# Altium schematic sheet ZHSD-BOOT-STORAGE.SchDoc
size A3; DocumentNumber: 9; SheetNumber: 9; SheetTotal: 17; Size: A3
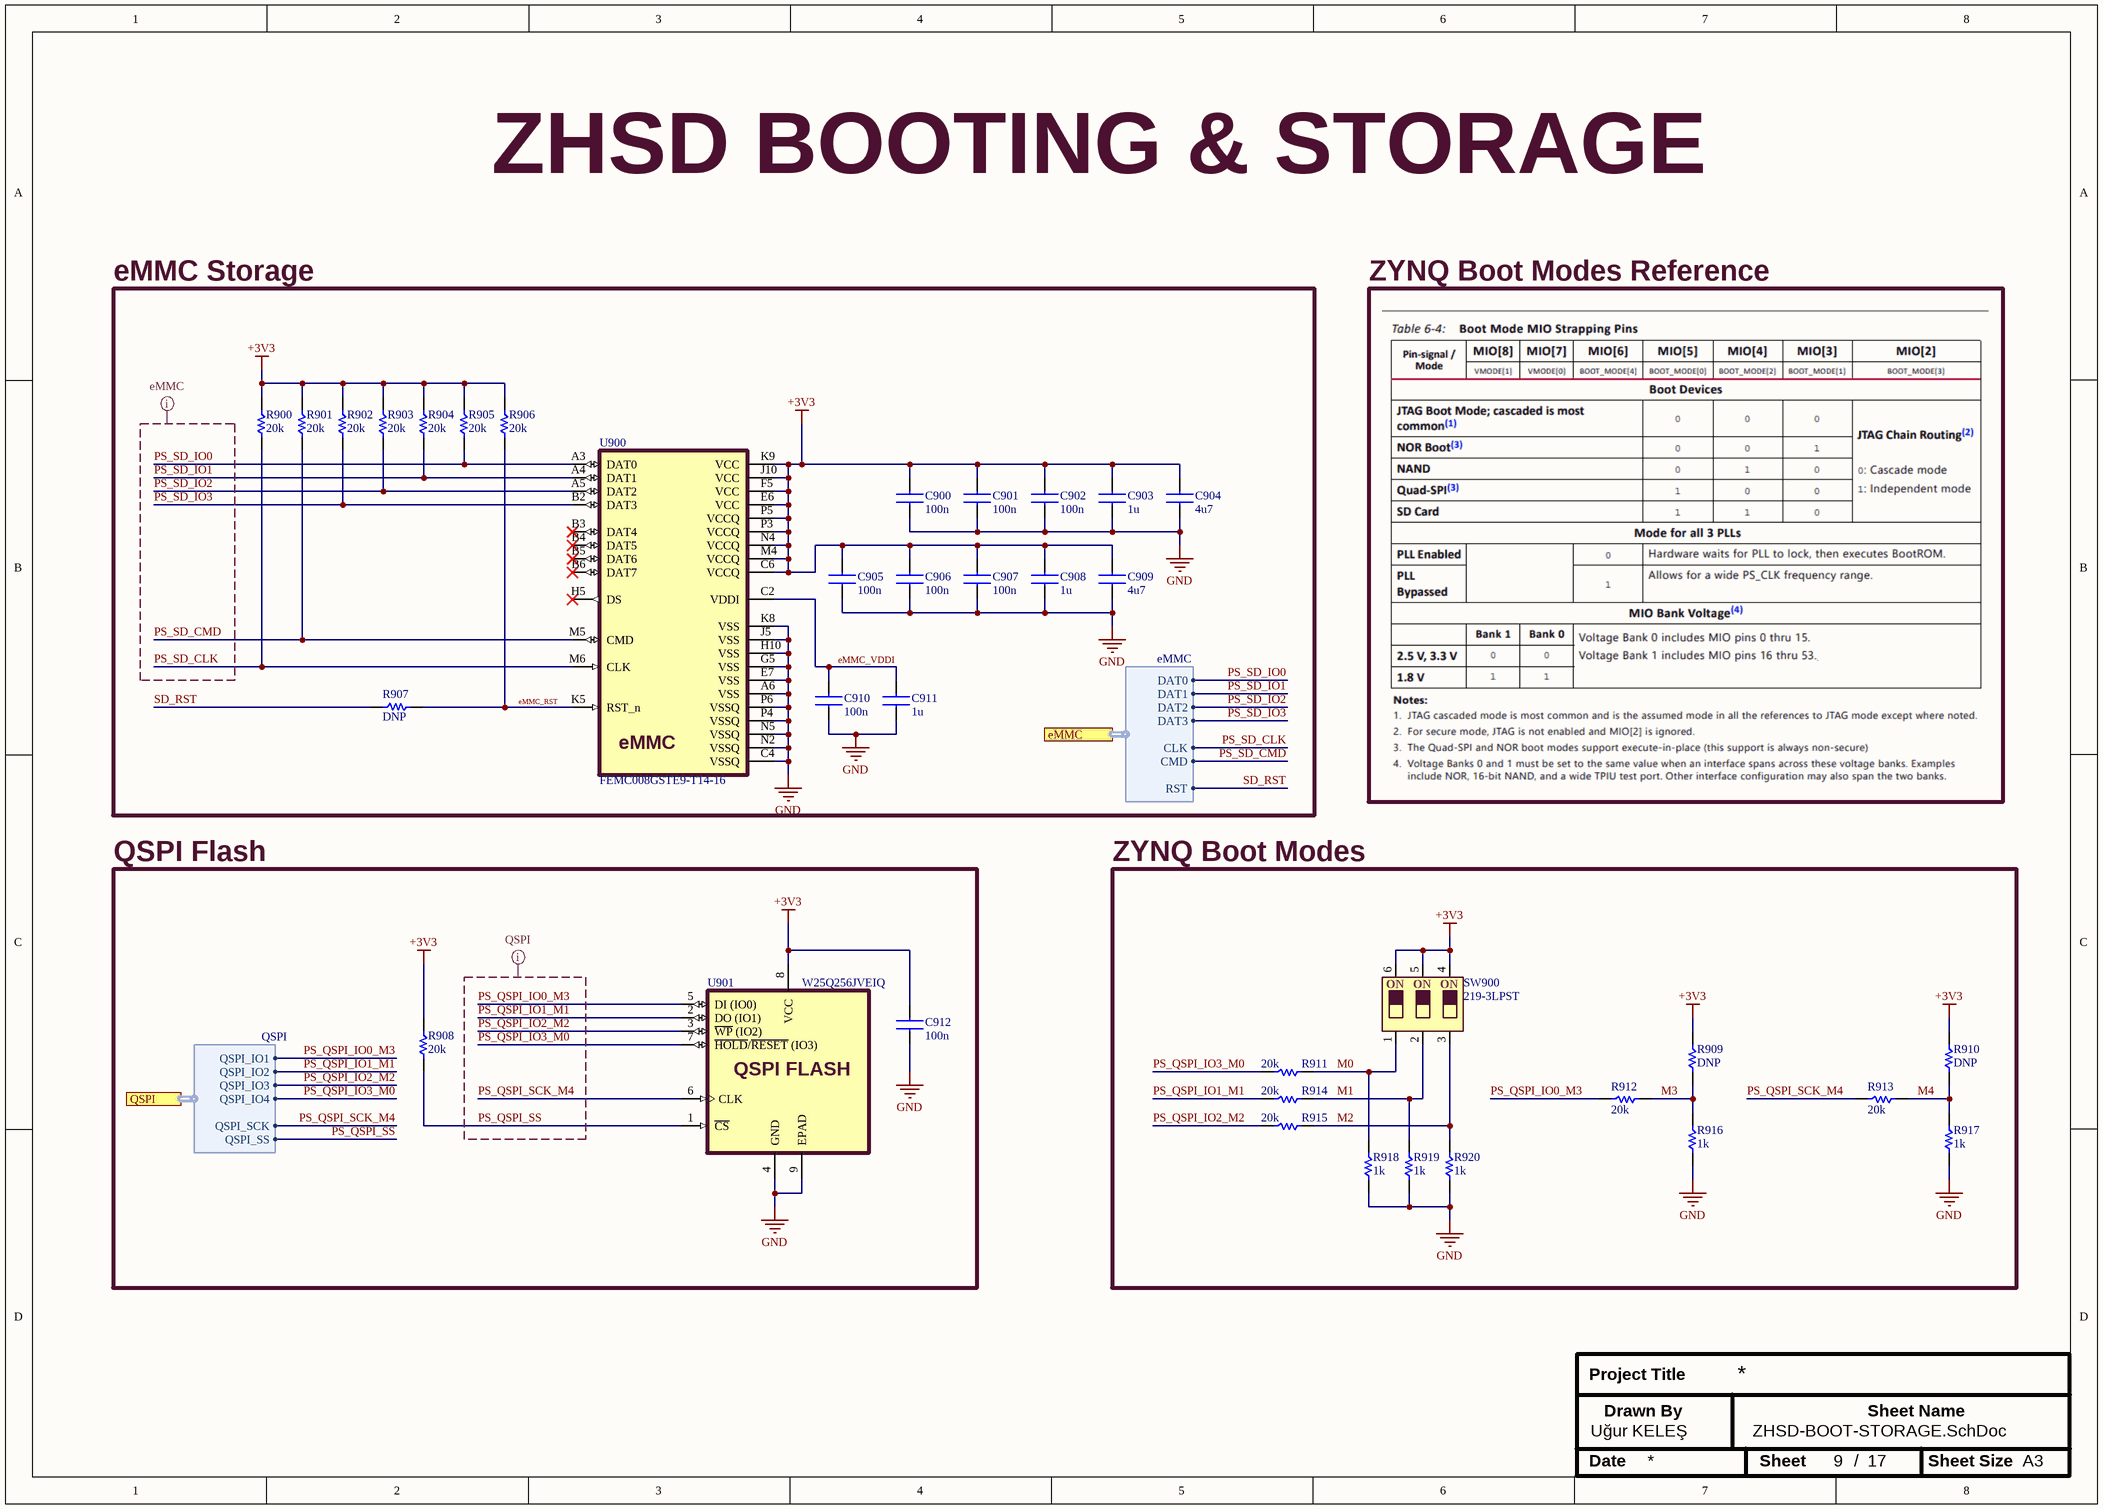
[diagram p0: ZHSD-BOOT-STORAGE.SchDoc]

## Parts
C900  100n  [0603CAPC1608X09N]
C901  100n  [0603CAPC1608X09N]
C902  100n  [0603CAPC1608X09N]
C903  1u  [0603CAPC1608X09N]
C904  4u7  [0603CAPC1608X09N]
C905  100n  [0603CAPC1608X09N]
C906  100n  [0603CAPC1608X09N]
C907  100n  [0603CAPC1608X09N]
C908  1u  [0603CAPC1608X09N]
C909  4u7  [0603CAPC1608X09N]
C910  100n  [0603CAPC1608X09N]
C911  1u  [0603CAPC1608X09N]
C912  100n  [0603CAPC1608X09N]
R900  20k  [0402RESC1005X04N]
R901  20k  [0402RESC1005X04N]
R902  20k  [0402RESC1005X04N]
R903  20k  [0402RESC1005X04N]
R904  20k  [0402RESC1005X04N]
R905  20k  [0402RESC1005X04N]
R906  20k  [0402RESC1005X04N]
R907  DNP  [0402RESC1005X04N]
R908  20k  [0402RESC1005X04N]
R909  DNP  [0402RESC1005X04N]
R910  DNP  [0402RESC1005X04N]
R911  20k  [0402RESC1005X04N]
R912  20k  [0402RESC1005X04N]
R913  20k  [0402RESC1005X04N]
R914  20k  [0402RESC1005X04N]
R915  20k  [0402RESC1005X04N]
R916  1k  [0402RESC1005X04N]
R917  1k  [0402RESC1005X04N]
R918  1k  [0402RESC1005X04N]
R919  1k  [0402RESC1005X04N]
R920  1k  [0402RESC1005X04N]
SW900  219-3LPST  [219-3LPST]
U900  FEMC008GSTE9-T14-16  [BGA153C50P14X14_1150X1300X100]
U901  W25Q256JVEIQ  [WSON8X6-SON127P800X80_HS-9N]

## Blocks framed on the sheet
eMMC Storage: C900-C911 R900-R907 U900
QSPI Flash: C912 R908 U901
ZYNQ Boot Modes: R909-R920 SW900

## Ports
eMMC (harness eMMC, see ZHSD-Block[8400,3700], ZHSD-ZYNQ-MIO[10600,2700]), QSPI (harness QSPI, see ZHSD-Block[8400,4400], ZHSD-ZYNQ-MIO[10200,8800])

## Harnesses
eMMC: DAT0, DAT1, DAT2, DAT3, CLK, CMD, RST
QSPI: QSPI_IO1, QSPI_IO2, QSPI_IO3, QSPI_IO4, QSPI_SCK, QSPI_SS

## Nets
+3V3: C900.2 C901.2 C902.2 C903.2 C904.2 C905.2 C906.2 C907.2 C908.2 C909.2 C912.2 R900.2 R901.2 R902.2 R903.2 R904.2 R905.2 R906.2 R908.2 R909.2 R910.2 SW900.4 SW900.5 SW900.6 U900.C6(VCCQ) U900.E6(VCC) U900.F5(VCC) U900.J10(VCC) U900.K9(VCC) U900.M4(VCCQ) U900.N4(VCCQ) U900.P3(VCCQ) U900.P5(VCCQ) U901.8(VCC)
GND: C900.1 C901.1 C902.1 C903.1 C904.1 C905.1 C906.1 C907.1 C908.1 C909.1 C910.1 C911.1 C912.1 R916.1 R917.1 R918.1 R919.1 R920.1 U900.A6(VSS) U900.C4(VSSQ) U900.E7(VSS) U900.G5(VSS) U900.H10(VSS) U900.J5(VSS) U900.K8(VSS) U900.N2(VSSQ) U900.N5(VSSQ) U900.P4(VSSQ) U900.P6(VSSQ) U901.4(GND) U901.9(EPAD)
eMMC_RST: R906.1 R907.2 U900.K5(RST_n)
eMMC_VDDI: C910.2 C911.2 U900.C2(VDDI)
M0: R911.1 R918.2 SW900.1
M1: R914.1 R919.2 SW900.2
M2: R915.1 R920.2 SW900.3
M3: R909.1 R912.1 R916.2
M4: R910.1 R913.1 R917.2
PS_QSPI_IO0_M3: R912.2 U901.5(DI_(IO0)) ; port QSPI.QSPI_IO1
PS_QSPI_IO1_M1: R914.2 U901.2(DO_(IO1)) ; port QSPI.QSPI_IO2
PS_QSPI_IO2_M2: R915.2 U901.3(~{WP}_(IO2)) ; port QSPI.QSPI_IO3
PS_QSPI_IO3_M0: R911.2 U901.7(~{HOLD}/~{RESET}_(IO3)) ; port QSPI.QSPI_IO4
PS_QSPI_SCK_M4: R913.2 U901.6(CLK) ; port QSPI.QSPI_SCK
PS_QSPI_SS: R908.1 U901.1(~{CS}) ; port QSPI.QSPI_SS
PS_SD_CLK: R900.1 U900.M6(CLK) ; port eMMC.CLK
PS_SD_CMD: R901.1 U900.M5(CMD) ; port eMMC.CMD
PS_SD_IO0: R905.1 U900.A3(DAT0) ; port eMMC.DAT0
PS_SD_IO1: R904.1 U900.A4(DAT1) ; port eMMC.DAT1
PS_SD_IO2: R903.1 U900.A5(DAT2) ; port eMMC.DAT2
PS_SD_IO3: R902.1 U900.B2(DAT3) ; port eMMC.DAT3
SD_RST: R907.1 ; port eMMC.RST

Not connected (* = marked no-connect by the designer): U900 B3(DAT4)* B4(DAT5)* B5(DAT6)* B6(DAT7)* H5(DS)*

## Layout directives
net class eMMC; rule Matched Net Lengths [Delay Tolerance = 50ps]: PS_SD_CLK, PS_SD_CMD, PS_SD_IO0, PS_SD_IO1, PS_SD_IO2, PS_SD_IO3
rule Matched Net Lengths [Delay Tolerance = 50ps]; net class QSPI: PS_QSPI_IO0_M3, PS_QSPI_IO1_M1, PS_QSPI_IO2_M2, PS_QSPI_IO3_M0, PS_QSPI_SCK_M4, PS_QSPI_SS

## Notes on the sheet
- ZHSD BOOTING & STORAGE
- ZYNQ Boot Modes Reference
- Project Title
- Uğur KELEŞ
- Drawn By
- Sheet Name
- Date
- Sheet
- /
- Sheet Size
- A3
- (in symbol 219-3LPST) ON
- (in symbol FEMC008GSTE9-T14-16) eMMC
- (in symbol W25Q256JVEIQ) QSPI FLASH

## Library data of the parts
C900-C902 C905-C907 C910 C912 = GRM155R71C104KA88J: CAP CER 0.1UF 16V X7R 0402 (1005) ±10%; Manufacturer: Murata Electronics; Value: 0.1 µF; ComponentLink1Description: Datasheet; ComponentLink1URL: https://search.murata.co.jp/Ceramy/image/img/A01X/G101/ENG/GRM155R71C104KA88-01.pdf; MPN: GRM155R71C104KA88J; Package: 0402; Tolerance: ±10%; Voltage: 16V
C903 C908 C911 = GRM188R61E105KA12D: CAP CER 1UF 25V X5R 0603 (1608) ±10%; Manufacturer: Murata Power Solutions Inc.; Value: 1 µF; ComponentLink1Description: Datasheet; ComponentLink1URL: https://search.murata.co.jp/Ceramy/image/img/A01X/G101/ENG/GRM188R61E105KA12-01.pdf; MPN: GRM188R61E105KA12D; Package: 0603; Tolerance: ±10%; Voltage: 25V
C904 C909 = CL10A475KP8NNNC: CAP CER 4.7UF 10V X5R 0603 (1608) ±10%; Manufacturer: Samsung Electro-Mechanics; Value: 4.7 µF; ComponentLink1Description: Datasheet; ComponentLink1URL: https://mm.digikey.com/Volume0/opasdata/d220001/medias/docus/609/CL10A475KP8NNNC_Spec.pdf; MPN: CL10A475KP8NNNC; Package: 0603; Tolerance: ±10%; Voltage: 10V
R900-R906 R908 R911-R915 = RC0402FR-0720KL: RES 20K OHM 1% 1/16W 0402 (1005); Manufacturer: YAGEO; Value: 20 kOhms; Voltage: 50V; ComponentLink1Description: Datasheet; ComponentLink1URL: https://yageogroup.com/content/datasheet/asset/file/PYU-RT_1-TO-0-01_ROHS_L; MPN: RC0402FR-0720KL; Tolerance: ±1%; Package: 0402
R907 R909 R910 = DNP_RES: DO NOT POPULATE RESISTOR; Manufacturer: ***; Value: ***; ComponentLink1Description: Datasheet; ComponentLink1URL: https://yageogroup.com/content/datasheet/asset/file/PYU-RT_1-TO-0-01_ROHS_L; MPN: ***; Voltage: ***; Tolerance: ***; Package: 0402
R916-R920 = RC0402JR-071KL: RES 1K OHM 5% 1/16W 0402 (1005); Manufacturer: YAGEO; Value: 1 kOhms; Voltage: 50V; ComponentLink1Description: Datasheet; ComponentLink1URL: https://yageogroup.com/content/datasheet/asset/file/PYU-RT_1-TO-0-01_ROHS_L; MPN: RC0402JR-071KL; Tolerance: ±5%; Package: 0402
SW900 = 219-3LPST: Dip Switch SPST 3 Position Surface Mount Slide (Standard) Actuator 100mA 20VDC; Manufacturer: CTS Electrocomponents; ComponentLink1Description: Datasheet; ComponentLink1URL: https://www.ctscorp.com/Files/DataSheets/Switches/DIP-Switches/CTS-Switches-DIP-219-Series-Datasheet.pdf; MPN: 219-3LPST
U900 = FEMC008GSTE9-T14-16: FLASH - NAND (MLC) Memory IC 64Gbit eMMC_5.1 200 MHz 153-FBGA (11.5x13); Manufacturer: Flexxon Pte Ltd; ComponentLink1Description: Datasheet; ComponentLink1URL: https://mm.digikey.com/Volume0/opasdata/d220001/medias/docus/6348/FLEXXON%20eMMC%205.1%20MLC%20%28XTRA%20III%20153ball%29%20SPEC%20V1.9.pdf; MPN: FEMC008GSTE9-T14-16; ComponentLink2Description: eMMC Design Guide; ComponentLink2URL: https://www.flexxon.com/wp-content/uploads/Technical%20Info/FLEXXON%20eMMC%20Design%20Guide%20(XTRA%20III%20153Balls)%20V1.2.pdf?x72842
U901 = W25Q256JVEIQ: FLASH - NOR Memory IC 256Mbit SPI - Quad I/O 133 MHz 8-WSON (8x6); Manufacturer: Winbond Electronics; ComponentLink1Description: Datasheet; ComponentLink1URL: https://www.winbond.com/resource-files/w25q256jv%20spi%20revg%2008032017.pdf; MPN: W25Q256JVEIQ